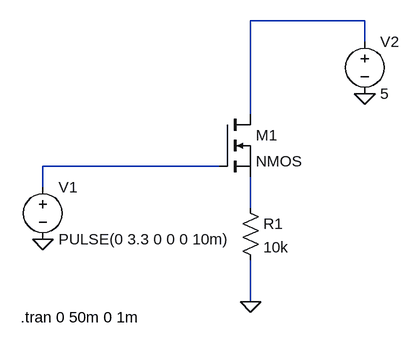
[diagram p0: schematic Draft11.asc]
Draft11.asc, the LTspice schematic file:
Version 4
SHEET 1 880 680
WIRE 400 -160 224 -160
WIRE 400 -128 400 -160
WIRE 224 -16 224 -160
WIRE 176 64 -96 64
WIRE -96 96 -96 64
WIRE 224 128 224 80
WIRE 224 272 224 208
FLAG 400 -48 0
FLAG -96 176 0
FLAG 224 272 0
SYMBOL voltage -96 80 R0
WINDOW 123 0 0 Left 0
WINDOW 39 0 0 Left 0
SYMATTR InstName V1
SYMATTR Value PULSE(0 3.3 0 0 0 10m)
SYMBOL voltage 400 -144 R0
SYMATTR InstName V2
SYMATTR Value 5
SYMBOL res 208 112 R0
SYMATTR InstName R1
SYMATTR Value 10k
SYMBOL nmos 176 -16 R0
SYMATTR InstName M1
TEXT -130 296 Left 2 !.tran 0 50m 0 1m

The netlist it stands for:
* Draft11.asc
V1 N002 0 PULSE(0 3.3 0 0 0 10m)
V2 N001 0 5
R1 N003 0 10k
M1 N001 N002 N003 N003 NMOS
.model NMOS NMOS
.model PMOS PMOS
.lib standard.mos
.tran 0 50m 0 1m
.backanno
.end